# Altium schematic sheet Gate-Driver.SchDoc: Slithr: Gate Driver
size A4; Date: 12/15/2015; Revision: 1; SheetNumber: 1; SheetTotal: 1
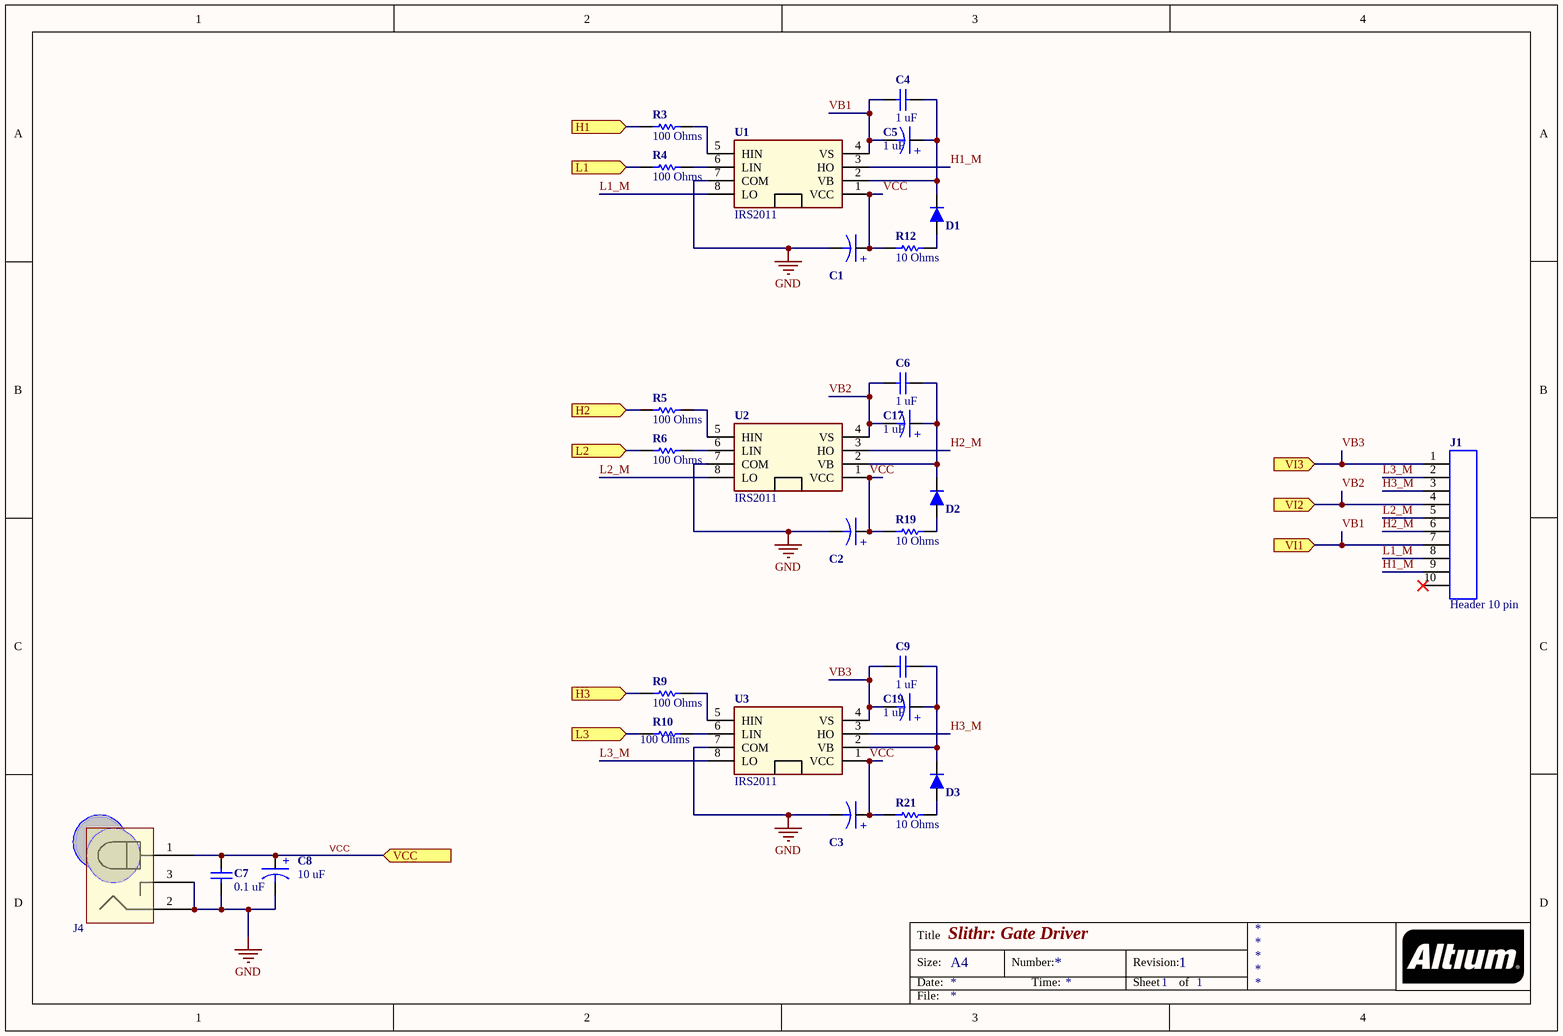
[diagram p0: Gate-Driver.SchDoc]

## Parts
C1  (no value)  [CAPMP3528X210N]
C2  (no value)  [CAPMP3528X210N]
C3  (no value)  [CAPMP3528X210N]
C4  1 uF  [CAP-0805(2012)-R]
C5  1 uF  [CAPMP6032X280N]
C6  1 uF  [CAP-0805(2012)-R]
C7  0.1 uF  [CAP-0402(1005)-R]
C8  10 uF  [CAPE5.0mm]
C9  1 uF  [CAP-0805(2012)-R]
C17  1 uF  [CAPMP6032X280N]
C19  1 uF  [CAPMP6032X280N]
D1  (no value)  [DO-214AC]
D2  (no value)  [DO-214AC]
D3  (no value)  [DO-214AC]
J1  Header 10 pin  [HEADER-10-100MIL]
J4  DC_Power-Jack  [Jack_M]  (value not drawn)
R3  100 Ohms  [R-0402(1005)-R]
R4  100 Ohms  [R-0402(1005)-R]
R5  100 Ohms  [R-0402(1005)-R]
R6  100 Ohms  [R-0402(1005)-R]
R9  100 Ohms  [R-0402(1005)-R]
R10  100 Ohms  [R-0402(1005)-R]
R12  10 Ohms  [R-0805(2012)-R]
R19  10 Ohms  [R-0805(2012)-R]
R21  10 Ohms  [R-0805(2012)-R]
U1  IRS2011  [SOIC-8]
U2  IRS2011  [SOIC-8]
U3  IRS2011  [SOIC-8]

## Ports
H1, H2, H3, L1, L2, L3, VCC, VI1, VI2, VI3

## Nets
GND: C1.2(NEGATIVE) C2.2(NEGATIVE) C3.2(NEGATIVE) C7.2 C8.2(NEGATIVE) J4.2(Sleeve) J4.3(Insertion_Detection) U1.7(COM) U2.7(COM) U3.7(COM)
H1: R3.1 ; port H1
H1_M: J1.9 U1.3(HO)
H2: R5.1 ; port H2
H2_M: J1.6 U2.3(HO)
H3: R9.1 ; port H3
H3_M: J1.3 U3.3(HO)
L1: R4.1 ; port L1
L1_M: J1.8 U1.8(LO)
L2: R6.1 ; port L2
L2_M: J1.5 U2.8(LO)
L3: R10.1 ; port L3
L3_M: J1.2 U3.8(LO)
VB1: C4.1 C5.2(NEGATIVE) J1.7 U1.4(VS) ; port VI1
VB2: C6.1 C17.2(NEGATIVE) J1.4 U2.4(VS) ; port VI2
VB3: C9.1 C19.2(NEGATIVE) J1.1 U3.4(VS) ; port VI3
VCC: C1.1(POSITIVE) C2.1(POSITIVE) C3.1(POSITIVE) C7.1 C8.1(POSITIVE) J4.1(Tip) R12.0 R19.0 R21.0 U1.1(VCC) U2.1(VCC) U3.1(VCC) ; port VCC
NetC4_2: C4.2 C5.1(POSITIVE) D1.K(CATHODE) U1.2(VB)
NetC6_2: C6.2 C17.1(POSITIVE) D2.K(CATHODE) U2.2(VB)
NetC9_2: C9.2 C19.1(POSITIVE) D3.K(CATHODE) U3.2(VB)
NetD1_A: D1.A(ANODE) R12.1
NetD2_A: D2.A(ANODE) R19.1
NetD3_A: D3.A(ANODE) R21.1
NetR3_2: R3.2 U1.5(HIN)
NetR4_2: R4.2 U1.6(LIN)
NetR5_2: R5.2 U2.5(HIN)
NetR6_2: R6.2 U2.6(LIN)
NetR9_2: R9.2 U3.5(HIN)
NetR10_2: R10.2 U3.6(LIN)

Not connected (* = marked no-connect by the designer): J1 10*

## Notes on the sheet
- Title
- Size:
- Date:
- A4
- Number:
- Time:
- Revision:
- Sheet
- of
- File:
- (in symbol CAP-1uF-63V-TANTB-TC-C) +
- (in symbol CAP-10uF-25V-ALC) +
- (in symbol CAP-10uF-63V-TANTB-TC-B) +

## Library data of the parts
C1-C3 = CAP-10uF-63V-TANTB-TC-B: CAP TANT, 10uF, 16V, TANT-B; Manufacturer: Vishay / Sprague; Manufacturer Part Number: TP3B106K016C0800AS; Mfr Case Code: B Case; Tolerance: 10 %; ESR: 800 mOhms; Leakage Current: 1.6 uA; Dissipation Factor DF: 6; Ripple Current: 0.33 A; Supplier 1: Mouser; RoHS: RoHS Compliant; Category: Tantalum Capacitors - Solid SMD; Stock 1: 2285; Pricing 1: 1=0.420, 10=0.340, 50=0.268, 100=0.237, 500=0.220, 2000=0.193, 4000=0.180, 10000=0.167, 20000=0.156 (USD); Capacitance: 10 uF; Height: 2.1 mm; Length: 3.5 mm; Operating Temperature Range: - 55 C to + 125 C; Package / Case: 1411 (3528 metric); Packaging: Reel; Product: Tantalum Solid Surface Mounts; Series: TP3; Termination Style: SMD/SMT; Voltage Rating: 16 V; Width: 2.8 mm; Brand: Vishay / Sprague; Case Code - in: 1411; Case Code - mm: 3528; Product Category: Low ESR Solid Tantalum Chip Capacitors; Tradename: TANTAMOUNT; RoHS - Mouser: Y; Minimum Order Quantity: 1; Reeling: True; ComponentLink1URL: http://www.mouser.com/ds/2/427/tp3-240030.pdf; ComponentLink1Description: http://www.mouser.com/ds/2/427/tp3-240030.pdf; Supplier Part Number 1: 74-TP3B106K016C0800A
C4 C6 C9 = CAP- 1 uF- 50 V-CER-0805(2012): CAP CER 1 UF 50V 10% Y5V 0805; Manufacturer: Yageo; Manufacturer Part Number: CC0805KKX7R8BB105; Type: Multilayer Ceramic Chip Capacitor; Voltage Rating DC: 25 VDC; Dielectric: X7R; RoHS: RoHS Compliant By Exemption; Category: Multilayer Ceramic Capacitors MLCC - SMD/SMT; Capacitance: 1 uF; Tolerance: 10 %; Package / Case: 0805 (2012 metric); Supplier 1: Mouser; Stock 1: 45582; Pricing 1: 1=0.120, 10=0.062, 100=0.028, 1000=0.022, 3000=0.017, 9000=0.015, 24000=0.014, 45000=0.013, 99000=0.010 (USD); Height: 1.25 mm; Length: 2 mm; Packaging: Reel; Product: General Type MLCCs; Series: CC; Termination Style: SMD/SMT; Width: 1.25 mm; Brand: Yageo; Case Code - in: 0805; Case Code - mm: 2012; Maximum Operating Temperature: + 125 C; Minimum Operating Temperature: - 55 C; RoHS - Mouser: E; Minimum Order Quantity: 1; Reeling: True; ComponentLink1URL: http://www.mouser.com/ds/2/447/UPY-GP_NP0_16V-to-50V_8-3714.pdf; ComponentLink1Description: http://www.mouser.com/ds/2/447/UPY-GP_NP0_16V-to-50V_8-3714.pdf; Supplier Part Number 1: 603-CC805KKX7R8BB105
C5 C17 C19 = CAP-1uF-63V-TANTB-TC-C: CAP, 1uF, 63V, TANT-B; Manufacturer: AVX; Manufacturer Part Number: TCJC105M063R0300; Mfr Case Code: C Case; Tolerance: 20 %; Type: Tantalum Solid Electrolytic Chip Capacitors  with Conductive Polymer Electrode; Voltage Rating: 63 VDC; ESR: 300 mOhms; Leakage Current: 3.6 uA; Dissipation Factor DF: 6; Supplier 1: Mouser; RoHS: RoHS Compliant; Category: Tantalum Capacitors - Polymer SMD; Stock 1: 984; Pricing 1: 1=1.71, 10=1.41, 100=0.826, 500=0.585, 1000=0.516, 2500=0.465, 10000=0.439, 25000=0.430 (USD); Capacitance: 1 uF; Diameter: -; Height: 2.8 mm; Length: 6 mm; Operating Temperature Range: - 55 C to + 125 C; Package / Case: 2312 (6032 metric); Packaging: Reel; Product: Tantalum Organic Polymer Standard Grade; Series: TCJ; Termination Style: SMD/SMT; Voltage Rating AC: -; Voltage Rating DC: 63 VDC; Width: 3.2 mm; Brand: AVX; Case Code - in: 2312; Case Code - mm: 6032; Maximum Operating Temperature: + 125 C; Minimum Operating Temperature: - 55 C; Product Category: Tantalum Solid Electrolytic Chip Capacitors w Conductive Polymer Electrode; Standard Pack Qty: 500; RoHS - Mouser: Y; Minimum Order Quantity: 1; Reeling: True; ComponentLink1URL: http://www.mouser.com/ds/2/40/tcj-776064.pdf; ComponentLink1Description: http://www.mouser.com/ds/2/40/tcj-776064.pdf; Supplier Part Number 1: 581-TCJC105M063R0300
C7 = CAP- 0.1 uF- 16 V-CER-0402(1005): CAP CER 0.1 UF 16V 5% X7R 0402; Manufacturer: Yageo; Manufacturer Part Number: CC0402KRX7R7BB104; Tolerance: 10 %; Type: Multilayer Ceramic Chip Capacitor; Voltage Rating DC: 16 VDC; Supplier 1: Mouser; RoHS: RoHS Compliant By Exemption; Category: Multilayer Ceramic Capacitors MLCC - SMD/SMT; Stock 1: 655262; Pricing 1: 1=0.100, 10=0.009, 100=0.004, 1000=0.003, 2500=0.002, 10000=0.002 (USD); Capacitance: 0.1 uF; Package / Case: 0402 (1005 metric); Packaging: Reel; Product: General Type MLCCs; Termination Style: SMD/SMT; Brand: Yageo; Case Code - in: 0402; Case Code - mm: 1005; Dielectric: X7R; Maximum Operating Temperature: + 125 C; Minimum Operating Temperature: - 55 C; Standard Pack Qty: 10000; RoHS - Mouser: E; Minimum Order Quantity: 1; Reeling: True; ComponentLink1URL: http://www.mouser.com/ds/2/447/UPY-GPHC_X7R_6.3V-to-50V_8-12304.pdf; ComponentLink1Description: http://www.mouser.com/ds/2/447/UPY-GPHC_X7R_6.3V-to-50V_8-12304.pdf; Supplier Part Number 1: 603-CC402KRX7R7BB104
C8 = CAP-10uF-25V-ALC: CAP, 10uF, 25V, ALC, 20%; Manufacturer: Vishay / Sprague; Manufacturer Part Number: 515D106M025JA6AE3; Voltage Rating DC: 25 VDC; Life: 2000 Hour; Ripple Current: 33 mA; Supplier 1: Mouser; RoHS: RoHS Compliant; Category: Aluminum Electrolytic Capacitors - Leaded; Stock 1: 5463; Pricing 1: 1=0.140, 25=0.137, 100=0.131, 250=0.117, 500=0.102, 1000=0.090, 2000=0.072, 5000=0.071, 10000=0.065 (USD); Capacitance: 10 uF; Diameter: 5 mm; Length: 11 mm; Packaging: Bulk; Product: General Purpose Electrolytic Capacitors; Series: 515D; Termination Style: Radial; Tolerance: 20 %; Brand: Vishay / Sprague; Lead Spacing: 2 mm; Maximum Operating Temperature: + 85 C; Product Category: Radial Aluminum Electrolytic Capacitors - 85 Degree; Standard Pack Qty: 200; RoHS - Mouser: Y; Minimum Order Quantity: 1; Reeling: False; ComponentLink1URL: http://www.mouser.com/ds/2/427/515d-239733.pdf; ComponentLink1Description: http://www.mouser.com/ds/2/427/515d-239733.pdf; Supplier Part Number 1: 75-515D106M025JA6AE3
D1-D3 = DIODE-ES1D: DIODE, ES1D Fairchild; Manufacturer: Fairchild Semiconductor; Configuration: Single; Max Surge Current: 30 A; Recovery Time: 15 ns; If - Forward Current: 1 A; Ir - Reverse Current: 5 uA; Pd - Power Dissipation: 1.47 W; Vf - Forward Voltage: 920 mV; Vr - Reverse Voltage: 200 V; Supplier 1: Mouser; Manufacturer Part Number: ES1D; RoHS: RoHS Compliant By Exemption; Category: Rectifiers; Stock 1: 51841; Pricing 1: 1=0.350, 10=0.227, 100=0.097, 1000=0.075, 2500=0.057, 7500=0.050, 22500=0.047, 45000=0.042, 97500=0.040 (USD); Package / Case: SMA; Packaging: Reel; Product: Ultra Fast Recovery Rectifiers; Series: ES1D; Brand: Fairchild Semiconductor; Mounting Style: SMD/SMT; Maximum Operating Temperature: + 150 C; Minimum Operating Temperature: - 50 C; Standard Pack Qty: 7500; RoHS - Mouser: E; Minimum Order Quantity: 1; Reeling: True; ComponentLink1URL: http://www.mouser.com/ds/2/149/ES1D-888870.pdf; ComponentLink1Description: http://www.mouser.com/ds/2/149/ES1D-888870.pdf; Supplier Part Number 1: 512-ES1D
J1 = CON-10Pin-100Mil: Header, 10pin, .1 pitch; Manufacturer: Molex; Manufacturer Part Number: 90136-1110; Current Rating: 3 A; Mounting Angle: Vertical; Number of Positions: 10 Position; Voltage Rating: 350 VAC/DC; Pitch: 2.54 mm; Latching Type: Latched; Supplier 1: Mouser; RoHS: RoHS Compliant; Category: Headers & Wire Housings; Stock 1: 29; Pricing 1: 1=1.23, 10=1.12, 100=0.916, 500=0.802, 1000=0.687, 2500=0.641, 5000=0.609 (USD); Accessory Type: -; Contact Plating: Tin; Contact Type: -; Housing Material: Polyester; Number of Rows: 1 Row; Packaging: Tray; Product: Headers; Series: 90136; Termination Style: Through Hole; Type: Shrouded; Brand: Molex; Contact Material: Brass; Mounting Style: Straight Pin; Row Spacing: -; Contact Gender: Pin (Male); Product Category: C-Grid Connectors; Standard Pack Qty: 880; Tradename: C-Grid; RoHS - Mouser: Y; Minimum Order Quantity: 1; Reeling: False; ComponentLink1URL: http://www.mouser.com/ds/2/276/0901361110_PCB_HEADERS-176811.pdf; ComponentLink1Description: http://www.mouser.com/ds/2/276/0901361110_PCB_HEADERS-176811.pdf; Supplier Part Number 1: 538-90136-1110
J4 = DC_Power-Jack: Manufacturer: CUI; Manufacturer Part Number: PJ-002B; Connector Type: DC Power Jack; Current Rating: 2.5 A; Inside Contact Diameter: 2.5 mm; Mounting Angle: Right; Outside Contact Diameter: 6.5 mm; Voltage Rating: 16 V; Insulation Resistance: 100 MOhms; Product Status: New at Mouser; Supplier 1: Mouser; RoHS: RoHS Compliant; Category: DC Power Connectors; Stock 1: 6978; Pricing 1: 1=0.930, 10=0.651, 100=0.437, 500=0.353, 1000=0.316, 2500=0.251, 5000=0.247, 10000=0.242, 25000=0.237 (USD); Product: Jacks; Termination Style: Through Hole; Brand: CUI; RoHS - Mouser: Y; Minimum Order Quantity: 1; Reeling: False; ComponentLink1URL: http://www.mouser.com/ds/2/670/pj-002b-515833.pdf; ComponentLink1Description: http://www.mouser.com/ds/2/670/pj-002b-515833.pdf; Supplier Part Number 1: 490-PJ-002B; Contact Plating: Nickel; Housing Material: Polybutylene Terephthalate (PBT); Operating Temperature Range: - 25 C to + 85 C; Contact Material: Copper; Flammability Rating: UL 94 V-0; Mounting Style: Through Hole; Contact Gender: Male
R3-R6 R9 R10 = R-100-62.5 mW-0402(1005): RES 100 OHM 62.5 mW 0402(1005) SMD; Manufacturer: Yageo; Manufacturer Part Number: RC0402FR-07100RL; Power Rating: 62.5 mW (1/16 W); Temperature Coefficient: 100 PPM / C; Tolerance: 1 %; Voltage Rating: 50 V; RoHS: RoHS Compliant; Category: Thick Film Resistors - SMD; Packaging: Reel; Resistance: 100 Ohms; Package / Case: 0402 (1005 metric); Height: 0.35 mm; Supplier 1: Mouser; Stock 1: 353272; Pricing 1: 1=0.100, 10=0.010, 100=0.003, 1000=0.002, 10000=0.001 (USD); Length: 1 mm; Operating Temperature Range: - 55 C to + 155 C; Product: Thick Film Resistors General Purpose; Series: RC; Termination Style: SMD/SMT; Type: General Purpose Chip Resistor Surface Mount; Width: 0.5 mm; Brand: Yageo; Case Code - in: 0402; Case Code - mm: 1005; Product Category: 0402 SMD Chip Resistors; Standard Pack Qty: 10000; RoHS - Mouser: Y; Minimum Order Quantity: 1; Reeling: True; ComponentLink1URL: http://www.mouser.com/ds/2/447/PYu-RC0402_51_RoHS_L_6_r-8721.pdf; ComponentLink1Description: http://www.mouser.com/ds/2/447/PYu-RC0402_51_RoHS_L_6_r-8721.pdf; Supplier Part Number 1: 603-RC0402FR-07100RL
R12 R19 R21 = R-10-125mW-0805: RES 10 OHM 1/8W 0805 SMD; Manufacturer: Yageo; Manufacturer Part Number: RC0805FR-0710RL; Power Rating: 125 mW (1/8 W); Temperature Coefficient: 200 PPM / C; Tolerance: 1 %; Voltage Rating: 150 V; Supplier 1: Mouser; RoHS: RoHS Compliant; Category: Thick Film Resistors - SMD; Stock 1: 46426; Pricing 1: 1=0.100, 10=0.016, 100=0.006, 1000=0.004, 5000=0.003, 25000=0.002 (USD); Height: 0.5 mm; Length: 2 mm; Operating Temperature Range: - 55 C to + 155 C; Package / Case: 0805 (2012 metric); Packaging: Reel; Product: Thick Film Resistors General Purpose; Resistance: 10 Ohms; Series: RC; Termination Style: SMD/SMT; Type: General Purpose Chip Resistor Surface Mount; Width: 1.25 mm; Brand: Yageo; Case Code - in: 0805; Case Code - mm: 2012; Product Category: 0805 SMD Chip Resistors; Standard Pack Qty: 5000; RoHS - Mouser: Y; Minimum Order Quantity: 1; Reeling: True; ComponentLink1URL: http://www.mouser.com/ds/2/447/RC0805-257173.pdf; ComponentLink1Description: http://www.mouser.com/ds/2/447/RC0805-257173.pdf; Supplier Part Number 1: 603-RC0805FR-0710RL
U1-U3 = IRS2011(S)PBF: IC, HS/LS INDEPENDENT DRIVER; Manufacturer: International Rectifier; Manufacturer Part Number: IRS2011SPBF; Configuration: Non-Inverting; Number of Outputs: 2; Output Current: 1 A; Fall Time: 35 ns; Maximum Turn-Off Delay Time: 60 ns; Number of Drivers: 2 Driver; Operating Supply Current: 300 uA; Pd - Power Dissipation: 625 mW; Rise Time: 40 ns; Supply Voltage - Max: 20 V; Supply Voltage - Min: 10 V; Supplier 1: Mouser; RoHS: RoHS Compliant; Category: Gate Drivers; Stock 1: 1172; Pricing 1: 1=2.08, 10=1.77, 100=1.42, 500=1.24, 1000=1.02, 2500=0.955, 5000=0.920, 10000=0.850 (USD); Features: Independent; Package / Case: SOIC-8; Packaging: Tube; Product: Half-Bridge Drivers; Type: High and Low Side Driver; Brand: International Rectifier; Mounting Style: SMD/SMT; Maximum Operating Temperature: + 125 C; Maximum Turn-On Delay Time: 60 ns; Minimum Operating Temperature: - 40 C; Standard Pack Qty: 95; RoHS - Mouser: Y; Minimum Order Quantity: 1; Reeling: False; ComponentLink1URL: http://www.mouser.com/ds/2/200/irs2011pbf-90501.pdf; ComponentLink1Description: http://www.mouser.com/ds/2/200/irs2011pbf-90501.pdf; Supplier Part Number 1: 942-IRS2011SPBF